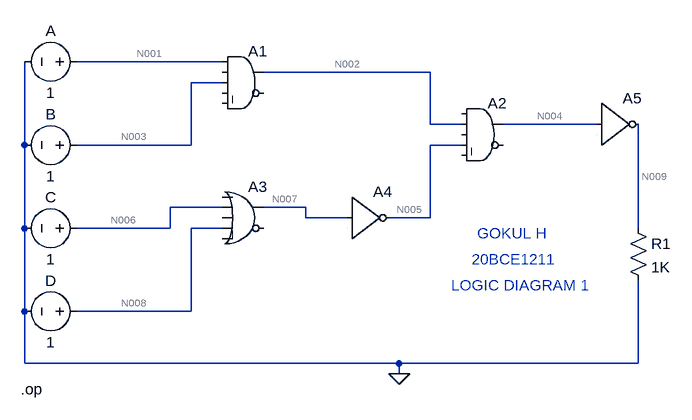
[diagram p0: schematic FAT.asc]
FAT.asc, the LTspice schematic file:
Version 4
SHEET 1 880 680
WIRE 80 -224 -144 -224
WIRE 400 -208 144 -208
WIRE 80 -192 32 -192
WIRE 400 -128 400 -208
WIRE 448 -128 400 -128
WIRE 656 -128 512 -128
WIRE -224 -96 -224 -224
WIRE 32 -96 32 -192
WIRE 32 -96 -144 -96
WIRE 448 -96 400 -96
WIRE 80 0 0 0
WIRE 208 0 144 0
WIRE 208 16 208 0
WIRE 272 16 208 16
WIRE 400 16 400 -96
WIRE 400 16 336 16
WIRE -224 32 -224 -96
WIRE 0 32 0 0
WIRE 0 32 -144 32
WIRE 80 32 32 32
WIRE 720 32 720 -128
WIRE -224 160 -224 32
WIRE 32 160 32 32
WIRE 32 160 -144 160
WIRE -224 240 -224 160
WIRE 352 240 -224 240
WIRE 720 240 720 112
WIRE 720 240 352 240
WIRE 352 256 352 240
FLAG 352 256 0
SYMBOL voltage -128 -224 R90
WINDOW 0 -32 56 VBottom 2
WINDOW 3 32 56 VTop 2
SYMATTR InstName A
SYMATTR Value 1
SYMBOL voltage -128 -96 R90
WINDOW 0 -32 56 VBottom 2
WINDOW 3 32 56 VTop 2
SYMATTR InstName B
SYMATTR Value 1
SYMBOL voltage -128 32 R90
WINDOW 0 -32 56 VBottom 2
WINDOW 3 32 56 VTop 2
SYMATTR InstName C
SYMATTR Value 1
SYMBOL voltage -128 160 R90
WINDOW 0 -32 56 VBottom 2
WINDOW 3 32 56 VTop 2
SYMATTR InstName D
SYMATTR Value 1
SYMBOL Digital\\and 112 -256 R0
SYMATTR InstName A1
SYMBOL Digital\\and 480 -176 R0
SYMATTR InstName A2
SYMBOL Digital\\or 112 -48 R0
SYMATTR InstName A3
SYMBOL Digital\\inv 272 -48 R0
SYMATTR InstName A4
SYMBOL Digital\\inv 656 -192 R0
SYMATTR InstName A5
SYMBOL res 704 16 R0
SYMATTR InstName R1
SYMATTR Value 1K
TEXT 472 40 Left 2 ;GOKUL H
TEXT 464 80 Left 2 ;20BCE1211
TEXT 432 120 Left 2 ;LOGIC DIAGRAM 1
TEXT -230 280 Left 2 !.op

The netlist it stands for:
* FAT.asc
V§A N001 0 1
V§B N003 0 1
V§C N006 0 1
V§D N008 0 1
A1 N001 0 N003 0 0 0 N002 0 AND
A2 0 N002 0 N005 0 0 N004 0 AND
A3 0 N006 0 N008 0 0 N007 0 OR
A4 N007 0 0 0 0 N005 0 0 BUF
A5 N004 0 0 0 0 N009 0 0 BUF
R1 N009 0 1K
* GOKUL H
* 20BCE1211
* LOGIC DIAGRAM 1
.op
.backanno
.end

* Results of the author's LTspice run, read from the files saved beside the schematic
* Operating Point:
*   V(n001) = 1 V
*   V(n003) = 1 V
*   V(n006) = 1 V
*   V(n008) = 1 V
*   V(n002) = 1 V
*   V(n005) = 0 V
*   V(n004) = 0 V
*   V(n007) = 1 V
*   V(n009) = 999 mV
*   I(R1) = 999 µA
*   I(D) = 0 A
*   I(C) = 0 A
*   I(B) = 0 A
*   I(A) = 0 A
*   I8(A5) = 999 µA
*   I6(A5) = -999 µA
*   I8(A4) = 0 A
*   I6(A4) = 0 A
*   I8(A3) = 0 A
*   I7(A3) = 0 A
*   I8(A2) = 0 A
*   I7(A2) = 0 A
*   I8(A1) = 0 A
*   I7(A1) = 0 A